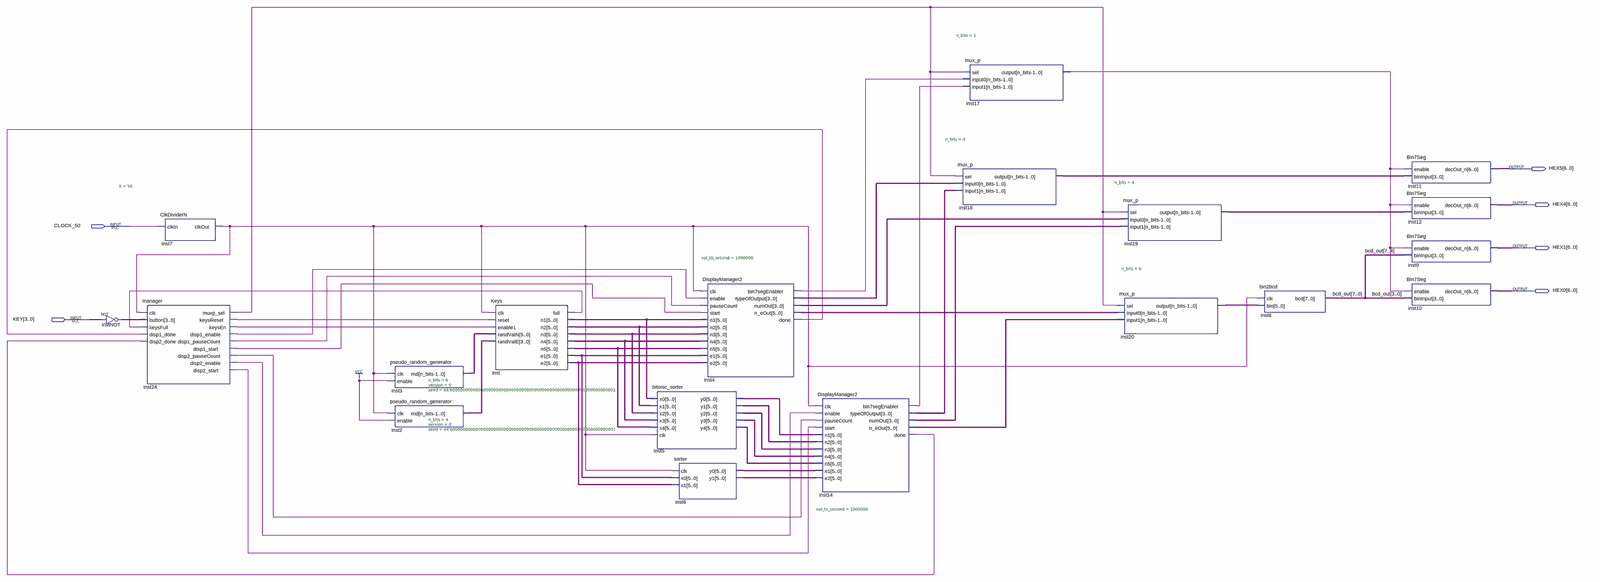
[diagram p0: schematic sheet, whole]
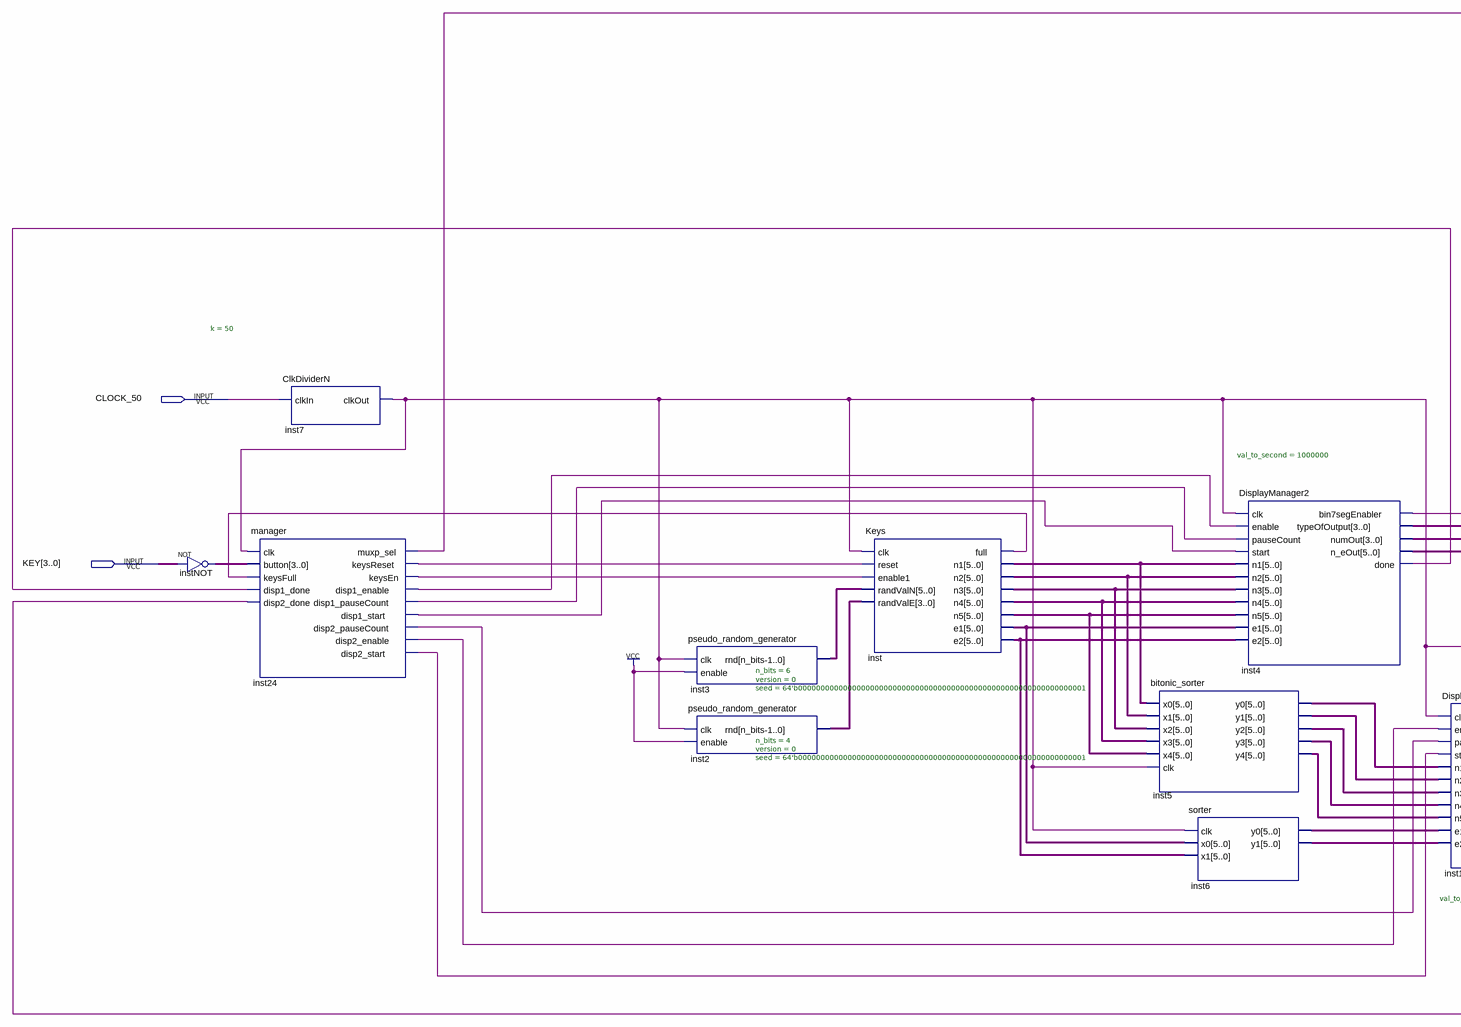
[diagram p1: schematic sheet, left part]
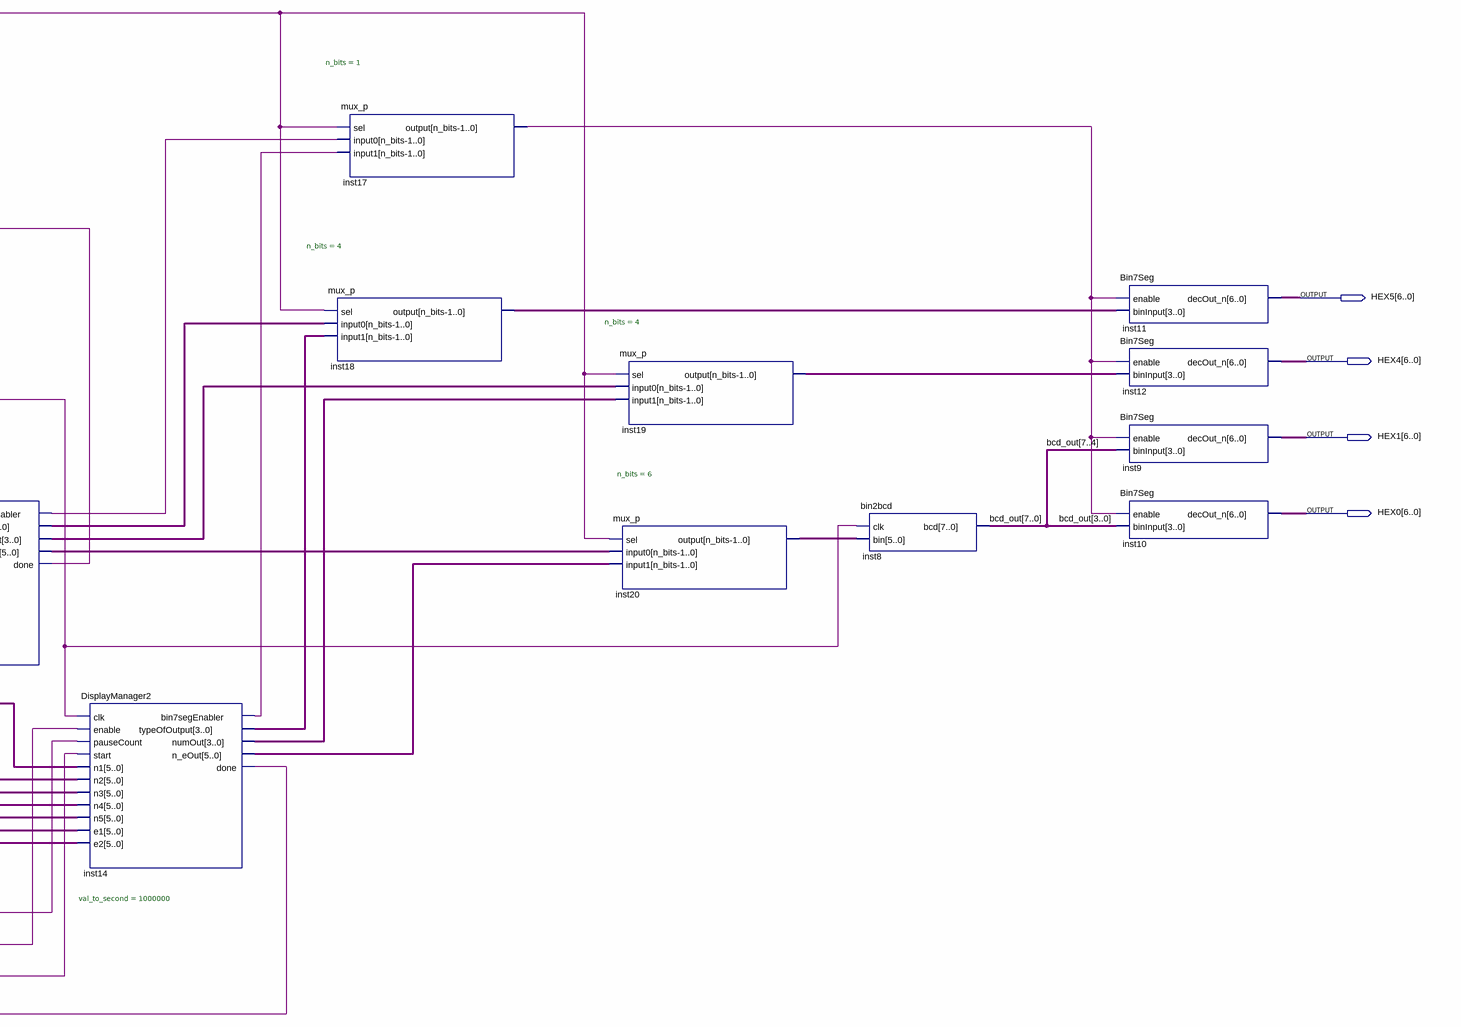
[diagram p2: schematic sheet, right part]
// Quartus schematic Projeto_Demo.bdf as structural Verilog: 19 symbols, 6 pins
module Projeto_Demo (
  input  CLOCK_50,
  input  [3:0] KEY,
  output [6:0] HEX5,
  output [6:0] HEX4,
  output [6:0] HEX1,
  output [6:0] HEX0
);

  wire inst4_bin7segenabler, inst4_done, inst7_clkout, inst14_bin7segenabler, inst14_done, inst17_output,
       inst24_disp1_enable, inst24_disp1_pausecount, inst24_disp1_start, inst24_disp2_enable,
       inst24_disp2_pausecount, inst24_disp2_start, inst24_keysen, inst24_keysreset, inst24_muxp_sel,
       inst_full;
  wire [3:0] inst2_rnd, inst4_numout, inst4_typeofoutput, inst14_numout, inst14_typeofoutput, inst18_output,
       inst19_output, instNOT_out;
  wire [5:0] inst3_rnd, inst4_n_eout, inst5_y0, inst5_y1, inst5_y2, inst5_y3, inst5_y4, inst6_y0, inst6_y1,
       inst14_n_eout, inst20_output, inst_e1, inst_e2, inst_n1, inst_n2, inst_n3, inst_n4, inst_n5;
  wire [7:0] bcd_out;

  assign instNOT_out = ~KEY;  // NOT instNOT, 4 bits wide
  manager inst24 (
    .clk(inst7_clkout), .button(instNOT_out), .keysFull(inst_full), .disp1_done(inst4_done),
    .disp2_done(inst14_done), .muxp_sel(inst24_muxp_sel), .keysReset(inst24_keysreset),
    .keysEn(inst24_keysen), .disp1_enable(inst24_disp1_enable), .disp1_pauseCount(inst24_disp1_pausecount),
    .disp1_start(inst24_disp1_start), .disp2_pauseCount(inst24_disp2_pausecount),
    .disp2_enable(inst24_disp2_enable), .disp2_start(inst24_disp2_start));
  ClkDividerN #(.k(50)) inst7 (.clkIn(CLOCK_50), .clkOut(inst7_clkout));
  pseudo_random_generator #(.n_bits(6), .version(0), .seed(64'b0000000000000000000000000000000000000000000000000000000000000001)) inst3 (
    .clk(inst7_clkout), .enable(1'b1), .rnd(inst3_rnd));
  pseudo_random_generator #(.n_bits(4), .version(0), .seed(64'b0000000000000000000000000000000000000000000000000000000000000001)) inst2 (
    .clk(inst7_clkout), .enable(1'b1), .rnd(inst2_rnd));
  Keys inst (
    .clk(inst7_clkout), .reset(inst24_keysreset), .enable1(inst24_keysen), .randValN(inst3_rnd),
    .randValE(inst2_rnd), .full(inst_full), .n1(inst_n1), .n2(inst_n2), .n3(inst_n3), .n4(inst_n4),
    .n5(inst_n5), .e1(inst_e1), .e2(inst_e2));
  bitonic_sorter inst5 (
    .x0(inst_n1), .x1(inst_n2), .x2(inst_n3), .x3(inst_n4), .x4(inst_n5), .clk(inst7_clkout), .y0(inst5_y0),
    .y1(inst5_y1), .y2(inst5_y2), .y3(inst5_y3), .y4(inst5_y4));
  sorter inst6 (.clk(inst7_clkout), .x0(inst_e1), .x1(inst_e2), .y0(inst6_y0), .y1(inst6_y1));
  DisplayManager2 #(.val_to_second(1000000)) inst4 (
    .clk(inst7_clkout), .enable(inst24_disp1_enable), .pauseCount(inst24_disp1_pausecount),
    .start(inst24_disp1_start), .n1(inst_n1), .n2(inst_n2), .n3(inst_n3), .n4(inst_n4), .n5(inst_n5),
    .e1(inst_e1), .e2(inst_e2), .bin7segEnabler(inst4_bin7segenabler), .typeOfOutput(inst4_typeofoutput),
    .numOut(inst4_numout), .n_eOut(inst4_n_eout), .done(inst4_done));
  DisplayManager2 #(.val_to_second(1000000)) inst14 (
    .clk(inst7_clkout), .enable(inst24_disp2_enable), .pauseCount(inst24_disp2_pausecount),
    .start(inst24_disp2_start), .n1(inst5_y0), .n2(inst5_y1), .n3(inst5_y2), .n4(inst5_y3), .n5(inst5_y4),
    .e1(inst6_y0), .e2(inst6_y1), .bin7segEnabler(inst14_bin7segenabler), .typeOfOutput(inst14_typeofoutput),
    .numOut(inst14_numout), .n_eOut(inst14_n_eout), .done(inst14_done));
  mux_p #(.n_bits(4)) inst18 (
    .sel(inst24_muxp_sel), .input0(inst4_typeofoutput), .input1(inst14_typeofoutput), .\output (inst18_output));
  mux_p #(.n_bits(1)) inst17 (
    .sel(inst24_muxp_sel), .input0(inst4_bin7segenabler), .input1(inst14_bin7segenabler),
    .\output (inst17_output));
  mux_p #(.n_bits(4)) inst19 (
    .sel(inst24_muxp_sel), .input0(inst4_numout), .input1(inst14_numout), .\output (inst19_output));
  mux_p #(.n_bits(6)) inst20 (
    .sel(inst24_muxp_sel), .input0(inst4_n_eout), .input1(inst14_n_eout), .\output (inst20_output));
  bin2bcd inst8 (.clk(inst7_clkout), .bin(inst20_output), .bcd(bcd_out));
  Bin7Seg inst11 (.enable(inst17_output), .binInput(inst18_output), .decOut_n(HEX5));
  Bin7Seg inst12 (.enable(inst17_output), .binInput(inst19_output), .decOut_n(HEX4));
  Bin7Seg inst9 (.enable(inst17_output), .binInput(bcd_out[7:4]), .decOut_n(HEX1));
  Bin7Seg inst10 (.enable(inst17_output), .binInput(bcd_out[3:0]), .decOut_n(HEX0));
endmodule
